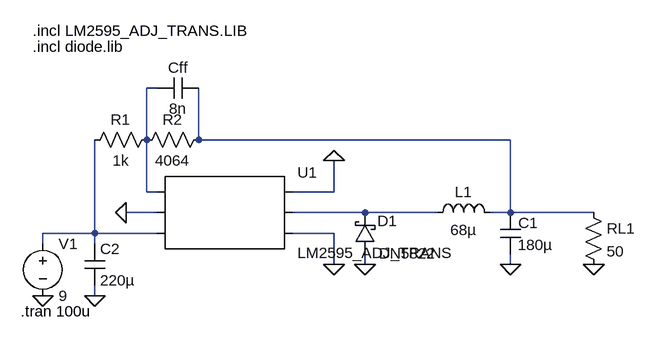
[diagram p0: schematic Draft1.asc]
Draft1.asc, the LTspice schematic file:
Version 4
SHEET 1 880 680
WIRE -32 32 -48 32
WIRE -48 112 -48 32
WIRE 32 112 32 32
WIRE 512 112 32 112
WIRE -48 192 -48 112
WIRE -32 192 -48 192
WIRE 240 192 240 144
WIRE 240 192 176 192
WIRE -32 224 -80 224
WIRE 288 224 176 224
WIRE 400 224 288 224
WIRE 512 224 512 112
WIRE 512 224 480 224
WIRE 640 224 512 224
WIRE -128 256 -128 112
WIRE -128 256 -208 256
WIRE -32 256 -128 256
WIRE 240 256 176 256
WIRE -208 272 -208 256
WIRE -128 272 -128 256
WIRE 240 304 240 256
WIRE 288 304 288 288
WIRE 512 304 512 288
WIRE -128 352 -128 336
FLAG 240 304 0
FLAG 240 144 0
FLAG 288 304 0
FLAG 512 304 0
FLAG -128 352 0
FLAG -80 224 0
FLAG 640 304 0
FLAG -208 352 0
SYMBOL AutoGenerated\\LM2595_ADJ_TRANS 64 224 R0
SYMATTR InstName U1
SYMBOL ind 384 240 R270
WINDOW 0 32 56 VTop 2
WINDOW 3 5 56 VBottom 2
SYMATTR InstName L1
SYMATTR Value 68µ
SYMBOL cap 496 224 R0
WINDOW 0 28 16 Left 2
WINDOW 3 27 50 Left 2
SYMATTR InstName C1
SYMATTR Value 180µ
SYMBOL cap -144 272 R0
SYMATTR InstName C2
SYMATTR Value 220µ
SYMBOL res 624 208 R0
SYMATTR InstName RL1
SYMATTR Value 50
SYMBOL voltage -208 256 R0
WINDOW 123 0 0 Left 0
WINDOW 39 0 0 Left 0
SYMATTR InstName V1
SYMATTR Value 9
SYMBOL schottky 304 288 R180
WINDOW 0 -34 51 Left 2
WINDOW 3 -94 1 Left 2
SYMATTR InstName D1
SYMATTR Value DN5822
SYMBOL res -32 96 R90
WINDOW 0 0 56 VBottom 2
WINDOW 3 32 56 VTop 2
SYMATTR InstName R1
SYMATTR Value 1k
SYMBOL res 48 96 R90
WINDOW 0 0 56 VBottom 2
WINDOW 3 32 56 VTop 2
SYMATTR InstName R2
SYMATTR Value 4064
SYMBOL cap 32 16 R90
WINDOW 0 0 32 VBottom 2
WINDOW 3 32 32 VTop 2
SYMATTR InstName Cff
SYMATTR Value 8n
TEXT -224 -32 Left 2 !.incl diode.lib
TEXT -224 -56 Left 2 !.incl LM2595_ADJ_TRANS.LIB
TEXT -242 376 Left 2 !.tran 100u

The netlist it stands for:
* Draft1.asc
* U1: LM2595_ADJ_TRANS (symbol AutoGenerated\LM2595_ADJ_TRANS not available, pins judged from their places): pin1=N001 pin2=0 pin3=N004 pin4=0 pin5=N003 pin6=0
L1 N003 N002 68µ
C1 N002 0 180µ
C2 N004 0 220µ
RL1 N002 0 50
V1 N004 0 9
D1 0 N003 DN5822
R1 N001 N004 1k
R2 N002 N001 4064
Cff N002 N001 8n
.model D D
.lib standard.dio
.incl diode.lib
.incl LM2595_ADJ_TRANS.LIB
.tran 100u
.backanno
.end